# EAGLE schematic eNode_Spark (EAGLE 6.4)

## Sheet 1 of 3: Power & MCU
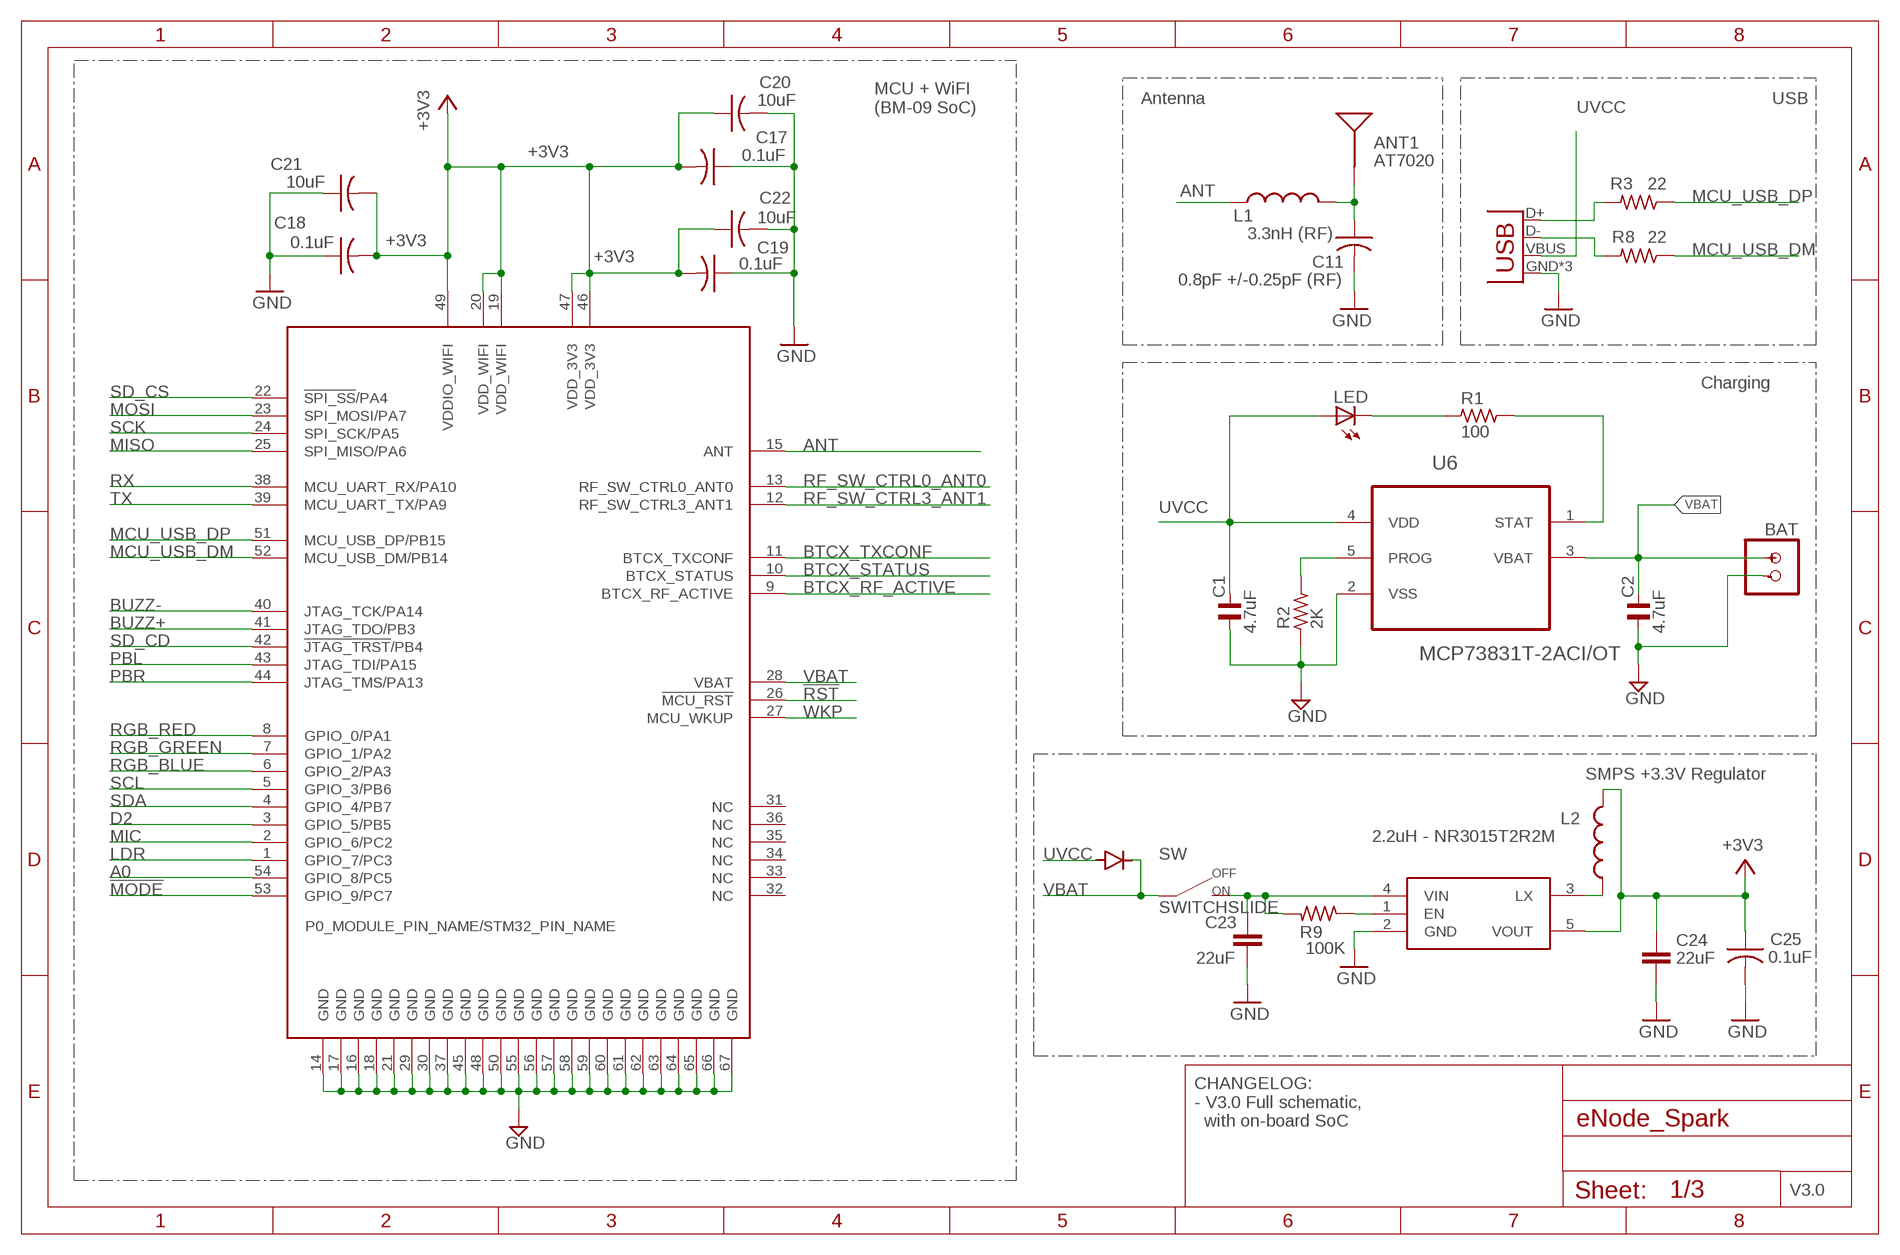
[diagram p0: schematic, sheet 1]

### Parts
ANT1  AT7020  [AT7020]
BAT  BATTERYSMT  [JST-2-SMD]
C1  4.7uF  C_0402  [C0402]
C2  4.7uF  C_0402  [C0402]
C11  0.8pF +/-0.25pF (RF)  C-US  [C0402_B]
C17  0.1uF  C-US  [C0402_B]
C18  0.1uF  C-US  [C0402_B]
C19  0.1uF  C-US  [C0402_B]
C20  10uF  C-US  [C0402_B]
C21  10uF  C-US  [C0402_B]
C22  10uF  C-US  [C0402_B]
C23  22uF  C-EUC0603  [C0603]
C24  22uF  C-EUC0603  [C0603]
C25  0.1uF  C-USC0402  [C0402]
D1  DIODE  [DIODE-DO-220AA(SMP)]
L1  3.3nH (RF)  INDUCTOR  [L0402_B]
L2  2.2uH - NR3015T2R2M  INDUCTORB  [INDUCTOR-NR3015]
LED  LED  [RA_SMD_LED]
R1  100  R_0603  [R0603]
R2  2K  R_0603  [R0603]
R3  22  R-US_  [R0402_B]
R8  22  R-US_  [R0402_B]
R9  100K  R-US_  [R0402_B]
SW  SWITCHSLIDE  [CHANGE_OVER_SLIDE]
U6  MCP73831T-2ACI/OT  [SOT95P280X145-5N]
U10  WM-N-BM-09  [WM-N-BM-09]
U$7  R8008-33  [SOT23-5]
X1  USB-MICROB  USBUSB-MICROB-SLOT-HOLE  [USB-MICROB-SLOT-HOLE]

### Nets
!MODE: U10.53(GPIO_9/PC7)
!RST: U10.26(!MCU_RST)
+3V3: C17.2 C18.2 C19.2 C20.1 C21.2 C22.1 C24.1 C25.1 L2.2 U10.19(VDD_WIFI) U10.20(VDD_WIFI) U10.46(VDD_3V3) U10.47(VDD_3V3) U10.49(VDDIO_WIFI) U$7.5(VOUT) ; also sheet 2,3
A0: U10.54(GPIO_8/PC5)
ANT [RF]: L1.1 U10.15(ANT)
BTCX_RF_ACTIVE: U10.9(BTCX_RF_ACTIVE)
BTCX_STATUS: U10.10(BTCX_STATUS)
BTCX_TXCONF: U10.11(BTCX_TXCONF)
BUZZ+: U10.41(JTAG_TDO/PB3) ; also sheet 3
BUZZ-: U10.40(JTAG_TCK/PA14) ; also sheet 3
D2: U10.3(GPIO_5/PB5)
ENABLE [vcc]: R9.1 U$7.1(EN)
GND: BAT.- C1.1 C2.1 C11.2 C17.1 C18.1 C19.1 C20.2 C21.1 C22.2 C23.2 C24.2 C25.2 R2.1 U6.2(VSS) U10.14(GND) U10.16(GND) U10.17(GND) U10.18(GND) U10.21(GND) U10.29(GND) U10.30(GND) U10.37(GND) U10.45(GND) U10.48(GND) U10.50(GND) U10.55(GND) U10.56(GND) U10.57(GND) U10.58(GND) U10.59(GND) U10.60(GND) U10.61(GND) U10.62(GND) U10.63(GND) U10.64(GND) U10.65(GND) U10.66(GND) U10.67(GND) U$7.2(GND) X1.GND X1.MT1(GND) X1.MT2(GND) ; also sheet 2,3
LDR: U10.1(GPIO_7/PC3) ; also sheet 3
MCU_USB_DM: R8.1 U10.52(MCU_USB_DM/PB14)
MCU_USB_DP: R3.1 U10.51(MCU_USB_DP/PB15)
MIC: U10.2(GPIO_6/PC2) ; also sheet 3
MISO: U10.25(SPI_MISO/PA6) ; also sheet 3
MOSI: U10.23(SPI_MOSI/PA7) ; also sheet 3
N$1 [RF]: ANT1.1(SIGNAL) C11.1 L1.2
N$3: L2.1 U$7.3(LX)
N$4: R2.2 U6.5(PROG)
N$5: LED.C R1.1
N$6: R1.2 U6.1(STAT)
N$17: R8.2 X1.D-
N$18: R3.2 X1.D+
PBL: U10.43(JTAG_TDI/PA15) ; also sheet 3
PBR: U10.44(JTAG_TMS/PA13) ; also sheet 3
RF_SW_CTRL0_ANT0: U10.13(RF_SW_CTRL0_ANT0)
RF_SW_CTRL3_ANT1: U10.12(RF_SW_CTRL3_ANT1)
RGB_BLUE: U10.6(GPIO_2/PA3) ; also sheet 3
RGB_GREEN [vcc]: U10.7(GPIO_1/PA2) ; also sheet 3
RGB_RED: U10.8(GPIO_0/PA1) ; also sheet 3
RX: U10.38(MCU_UART_RX/PA10) ; also sheet 3
SCK: U10.24(SPI_SCK/PA5) ; also sheet 3
SCL: U10.5(GPIO_3/PB6) ; also sheet 2
SD_CD: U10.42(!JTAG_TRST!/PB4) ; also sheet 3
SD_CS: U10.22(!SPI_SS!/PA4) ; also sheet 3
SDA: U10.4(GPIO_4/PB7) ; also sheet 2
TX: U10.39(MCU_UART_TX/PA9) ; also sheet 3
UVCC: C1.2 D1.ANODE LED.A U6.4(VDD) X1.VBUS
VBAT: BAT.+ C2.2 C23.1 D1.CATHODE R9.2 SW.1 SW.2 U6.3(VBAT) U10.28(VBAT) U$7.4(VIN)
WKP: U10.27(MCU_WKUP)
Unconnected: U10.31(NC) U10.32(NC) U10.33(NC) U10.34(NC) U10.35(NC) U10.36(NC)

### Notes on the sheet
- Antenna | USB
- MCU + WiFI
  (BM-09 SoC)
- Charging
- SMPS +3.3V Regulator
- CHANGELOG:
  - V3.0 Full schematic, 
    with on-board SoC
- V3.0

## Sheet 2 of 3: I2C
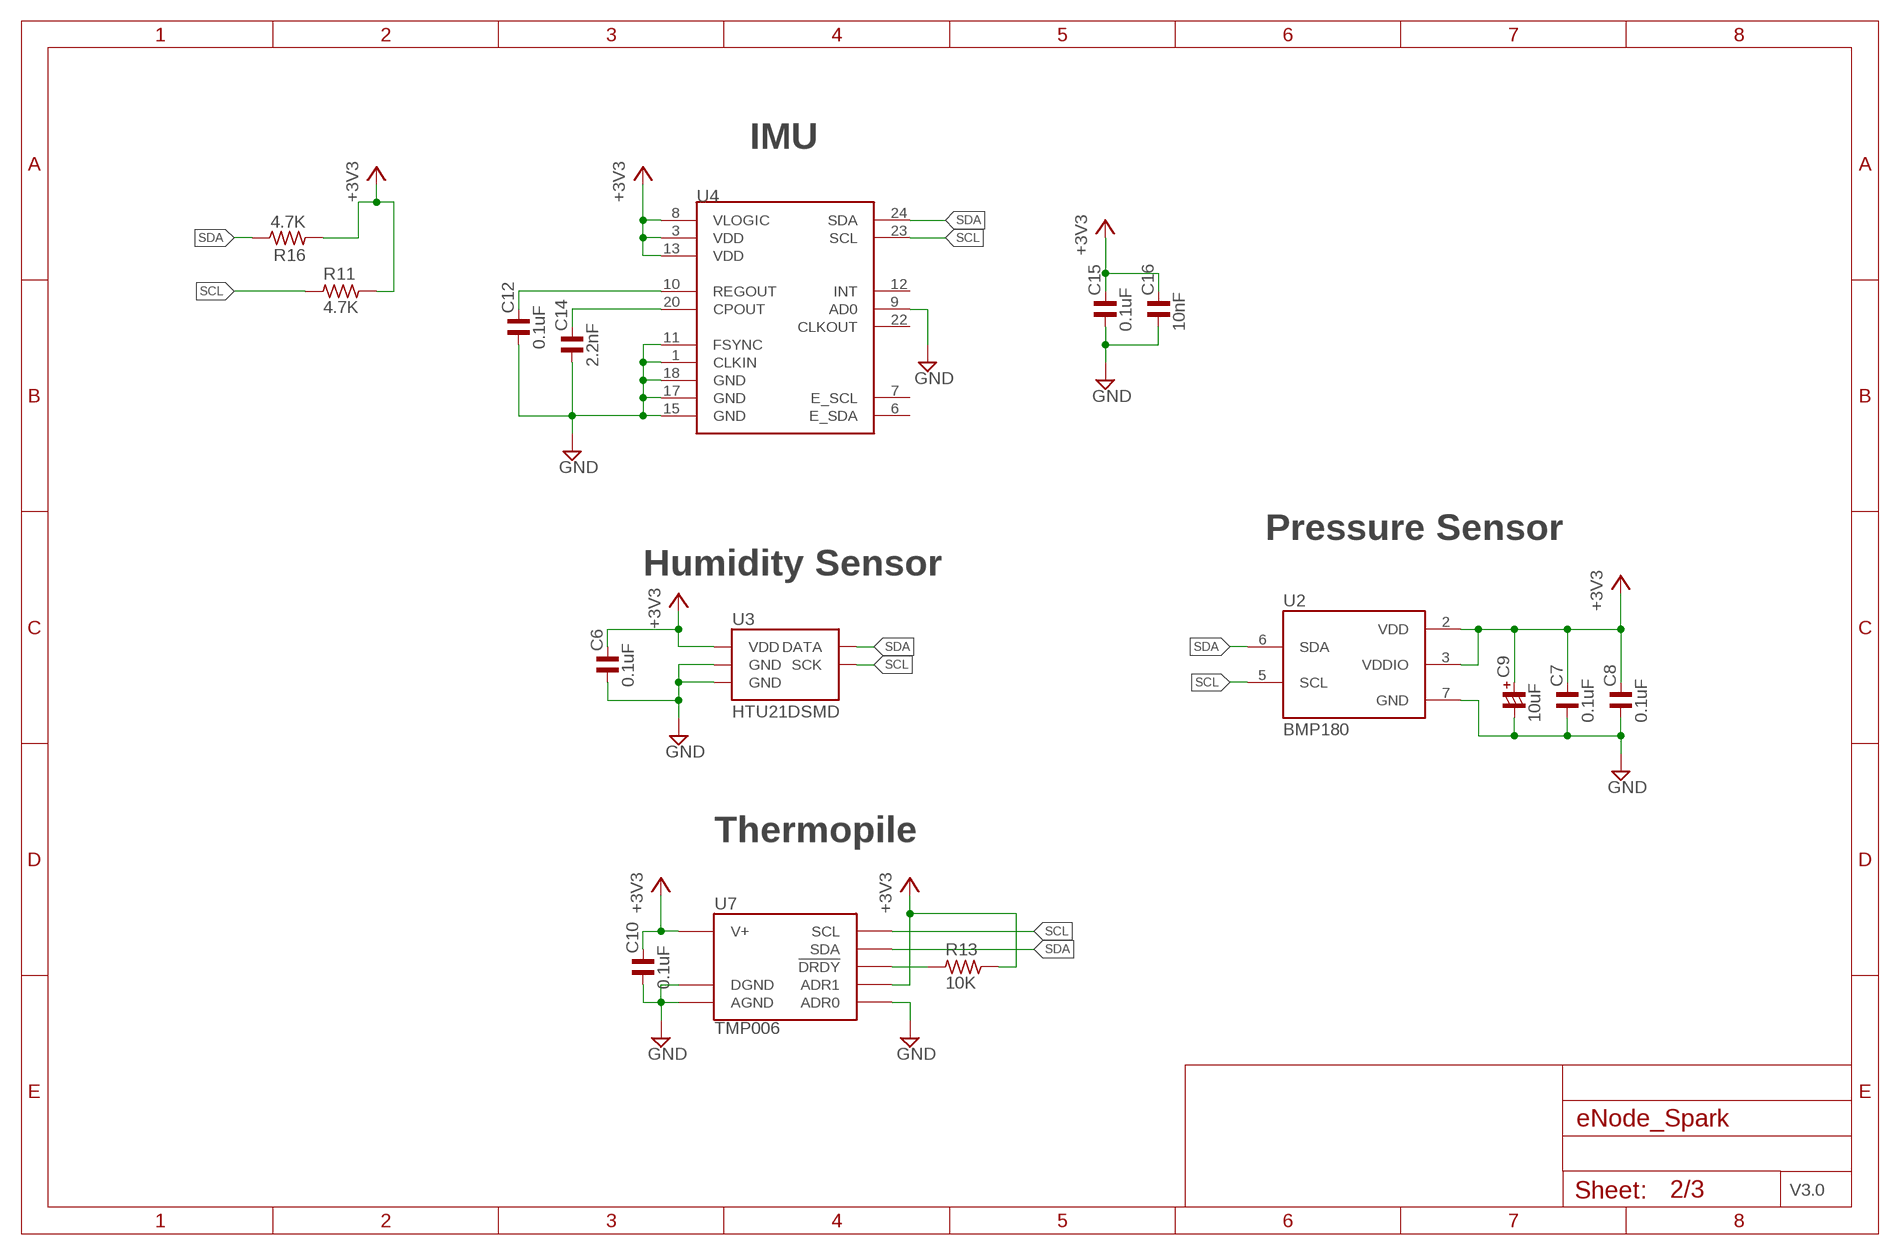
[diagram p1: schematic, sheet 2]

### Parts
C6  0.1uF  C_0402  [C0402]
C7  0.1uF  C_0402  [C0402]
C8  0.1uF  C_0402  [C0402]
C9  10uF  CP_1206/T  [C1206/T]
C10  0.1uF  C_0402  [C0402]
C12  0.1uF  C_0402  [C0402]
C14  2.2nF  C_0402  [C0402]
C15  0.1uF  C_0402  [C0402]
C16  10nF  C_0402  [C0402]
R11  4.7K  R_0603  [R0603]
R13  10K  R_0603  [R0603]
R16  4.7K  R_0603  [R0603]
U2  BMP180  [BMP180]
U3  HTU21DSMD  [HTU21D]
U4  MPU-9150QFN-24-NP  [QFN-24-NP]
U7  TMP006  [BGA8DS]

### Nets
+3V3: C6.2 C7.2 C8.2 C9.+ C10.2 C15.2 C16.2 R11.2 R13.2 R16.1 U2.2(VDD) U2.3(VDDIO) U3.VDD U4.3(VDD) U4.8(VLOGIC) U4.13(VDD) U7.A3(V+) U7.B1(ADR1) ; also sheet 1,3
GND: C6.1 C7.1 C8.1 C9.- C10.1 C12.1 C14.1 C15.1 C16.1 U2.7(GND) U3.7(GND) U3.GND U4.1(CLKIN) U4.9(AD0) U4.11(FSYNC) U4.15(GND) U4.17(GND) U4.18(GND) U7.A1(DGND) U7.A2(AGND) U7.C1(ADR0) ; also sheet 1,3
N$12: C14.2 U4.20(CPOUT)
N$13: R13.1 U7.C2(!DRDY)
N$14: C12.2 U4.10(REGOUT)
SCL: R11.1 U2.5(SCL) U3.SCK U4.23(SCL) U7.B3(SCL) ; also sheet 1
SDA: R16.2 U2.6(SDA) U3.DATA U4.24(SDA) U7.C3(SDA) ; also sheet 1
Unconnected: U4.6(E_SDA) U4.7(E_SCL) U4.12(INT) U4.22(CLKOUT)

### Notes on the sheet
- IMU
- Pressure Sensor
- Humidity Sensor
- Thermopile
- V3.0

## Sheet 3 of 3: Other IO
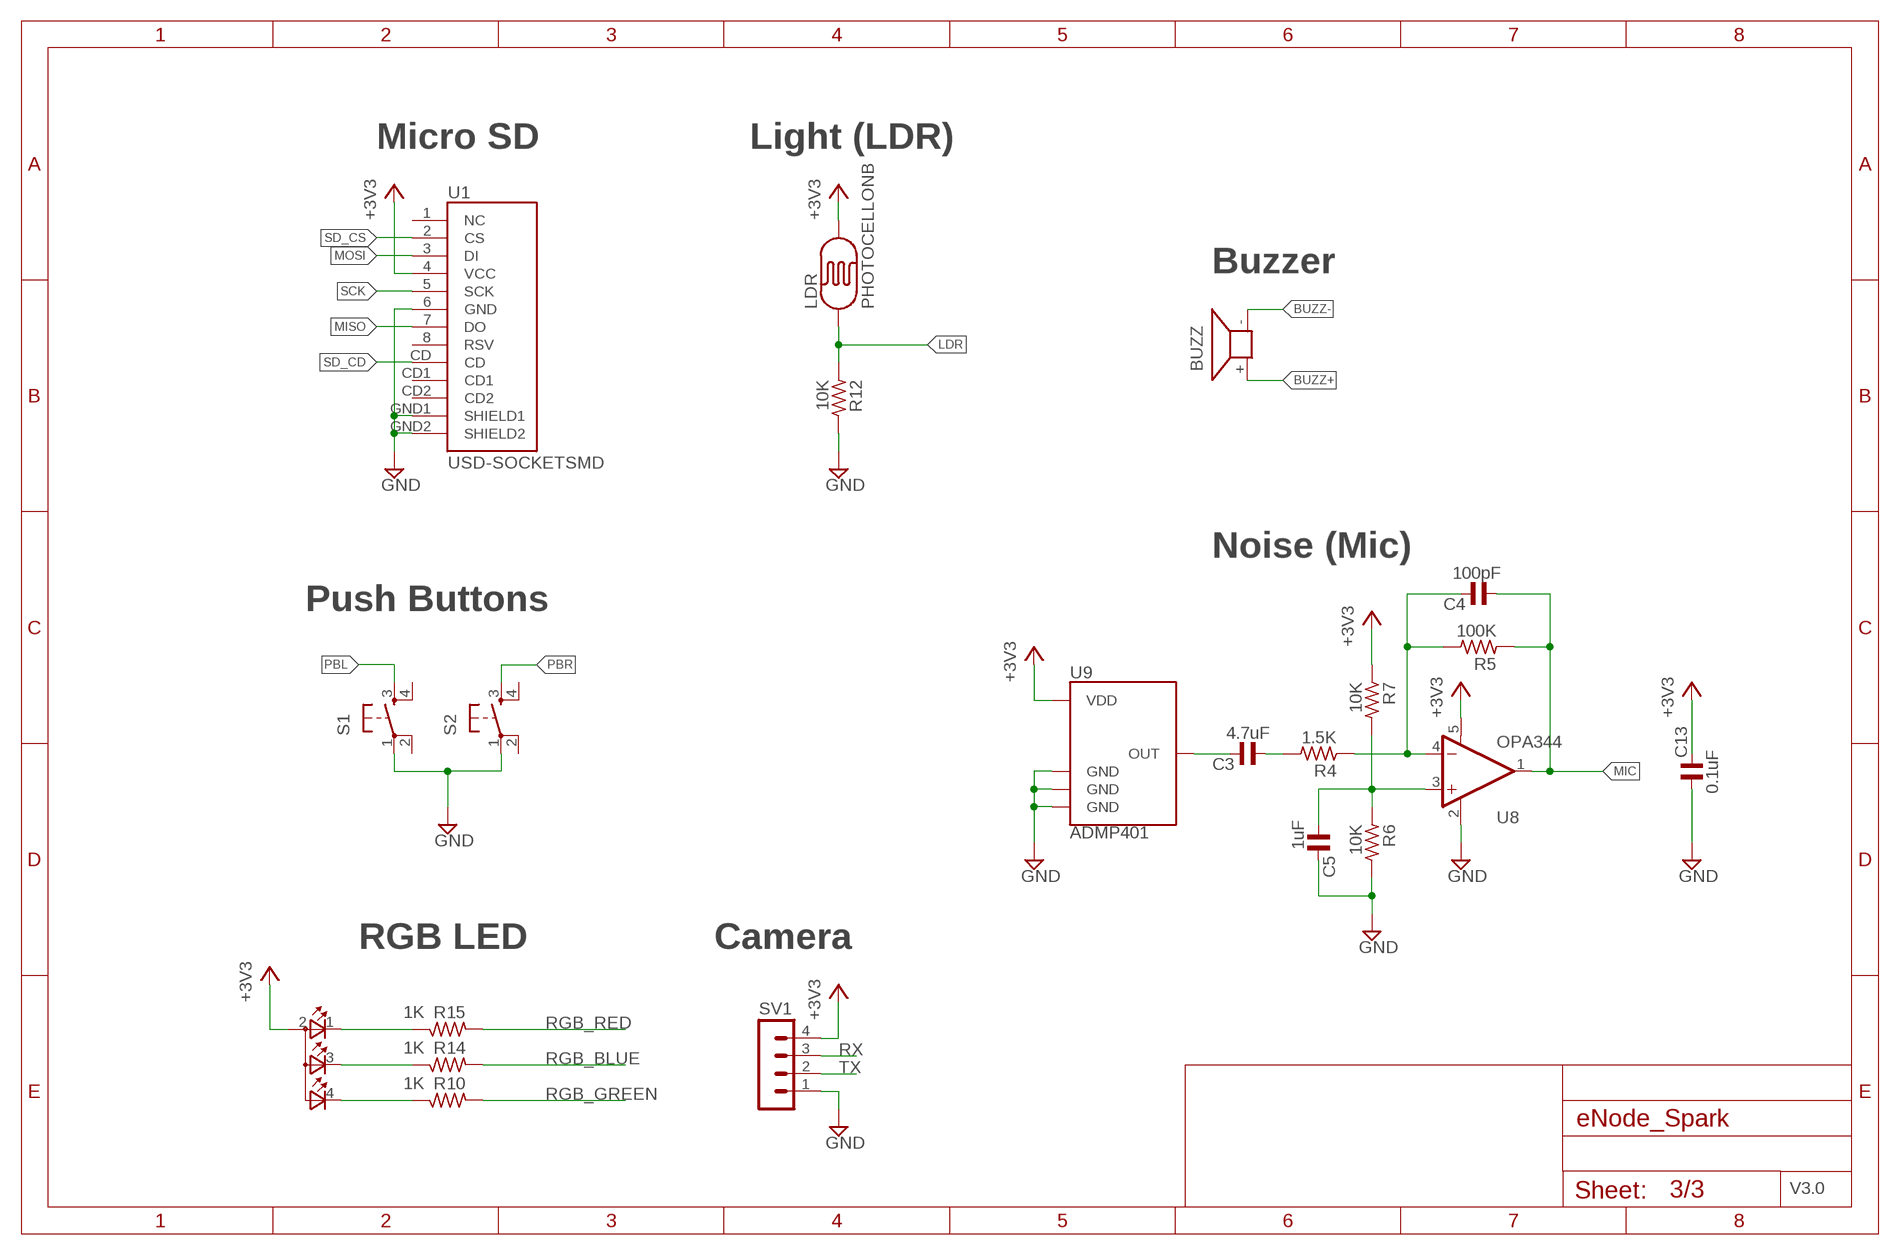
[diagram p2: schematic, sheet 3]

### Parts
BUZZ  BUZZER  [OFFBOARD_NOSIGN]
C3  4.7uF  C_0402  [C0402]
C4  100pF  C_0402  [C0402]
C5  1uF  C_0402  [C0402]
C13  0.1uF  C_0402  [C0402]
LDR  PHOTOCELLONB  [ON_BOARD]
LED2  CREE_CLVBA-FKA  TOPLED-3PLCC  [P-LCC-4-3]
R4  1.5K  R_0402  [R0402]
R5  100K  R_0402  [R0402]
R6  10K  R_0402  [R0402]
R7  10K  R_0402  [R0402]
R10  1K  R-US_  [R0402_B]
R12  10K  R_0603  [R0603]
R14  1K  R-US_  [R0402_B]
R15  1K  R-US_  [R0402_B]
S1  TAC_SWITCHSMD  [TACTILE_SWITCH_SMD]
S2  TAC_SWITCHSMD  [TACTILE_SWITCH_SMD]
SV1  MA04-1  [MA04-1]
U1  USD-SOCKETSMD  [MICRO-SD-SOCKET-PP]
U8  OPA344  [SOT23-5]
U9  ADMP401  [ADMP401]

### Nets
+3V3: C13.2 LDR.2 LED2.2(A2) R7.1 SV1.4 U1.4(VCC) U8.5(V+) U9.5(VDD) ; also sheet 1,2
BUZZ+: BUZZ.+ ; also sheet 1
BUZZ-: BUZZ.- ; also sheet 1
GND: C5.2 C13.1 R6.2 R12.2 S1.1 S2.1 SV1.1 U1.6(GND) U1.GND1(SHIELD1) U1.GND2(SHIELD2) U8.2(V-) U9.2(GND) U9.4(GND) U9.6(GND) ; also sheet 1,2
LDR: LDR.1 R12.1 ; also sheet 1
MIC: C4.1 R5.1 U8.1(OUT) ; also sheet 1
MISO: U1.7(DO) ; also sheet 1
MOSI: U1.3(DI) ; also sheet 1
N$2: C3.2 U9.1(OUT)
N$7: C3.1 R4.2
N$8: C4.2 R4.1 R5.2 U8.4(-IN)
N$9: C5.1 R6.1 R7.2 U8.3(+IN)
N$27: LED2.3(CBLUE) R14.1
N$29: LED2.4(CGREEN) R10.1
N$54: LED2.1(CRED) R15.1
PBL: S1.3 ; also sheet 1
PBR: S2.3 ; also sheet 1
RGB_BLUE: R14.2 ; also sheet 1
RGB_GREEN [vcc]: R10.2 ; also sheet 1
RGB_RED: R15.2 ; also sheet 1
RX: SV1.3 ; also sheet 1
SCK: U1.5(SCK) ; also sheet 1
SD_CD: U1.CD ; also sheet 1
SD_CS: U1.2(CS) ; also sheet 1
TX: SV1.2 ; also sheet 1
Unconnected: S1.2 S1.4 S2.2 S2.4 U1.1(NC) U1.8(RSV) U1.CD1 U1.CD2

### Notes on the sheet
- Micro SD | Light (LDR)
- Buzzer
- Noise (Mic)
- Push Buttons
- RGB LED | Camera
- V3.0

## Library data of the parts
ANT1 = Spark:AT7020
BAT = Battery:BATTERY: PIN HEADER
BUZZ = Buzzer:BUZZER: Buzzer
C1-C8 C10 C12-C16 = rc-master-smd:C_: NON-POLARIZED CAP
C9 = rc-master-smd:CP_: POLARIZED CAP
C11 C17-C22 = Spark:C-US: Capacitor
C23 C24 = rcl:C-EU: CAPACITOR, European symbol
C25 = adafruit:C-US: CAPACITOR, American symbol
D1 = Spark:DIODE
L1 L2 = Spark:INDUCTOR
LDR = LDR:PHOTOCELL: Photo Resitor
LED = LED:LED: LEDs
LED2 = SMD RGB LED:TOPLED-3: Cree CLVBA-FKA
R1 R2 R4-R7 R11-R13 R16 = rc-master-smd:R_: RESISTOR
R3 R8-R10 R14 R15 = Spark:R-US_: 0402 Resistor
S1 S2 = TACT BUTTON:TAC_SWITCH: SMD Tactiile Switch
SV1 = con-lstb:MA04-1: PIN HEADER; OC_FARNELL: unknown; OC_NEWARK: unknown
SW = Switch:SWITCH
U1 = MicroSD:USD-SOCKET: microSD Socket Push-push type uSD socket. Schematic element and footprint production proven. Spark Fun Electronics SKU : PRT-00127. tDoc lines correctly indicate media card edge positions when inserting (unlocked, locked, depressed).; ORDERCODE: 2143377; SUPPLIER: ELEMENT14
U2 = BMP180:BMP180: BOSCH BMP180 DIGITAL BAROMETRIC PRESSURE SENSOR Web page: http://www.bosch-sensortec.com/en/homepage/products_3/environmental_sensors_1/bmp180_1/bmp180 Datasheet: http://ae-bst.resource.bosch.com/media/products/dokumente/bmp180/BST-BMP180-DS000-09.pdf The BMP180 is the function compatible successor of the BMP085, a new generation of high precision digital pressure sensors for consumer applications. The ultra-low power, low voltage electronics of the BMP180 is optimized for use in mobile phones, PDAs, GPS navigation devices and outdoor equipment. With a low altitude noise of merely 0.25m at fast conversion time, the BMP180 offers superior performance. The I2C interface allows for easy system integration with a microcontroller. The BMP180 is based on piezo-resistive technology for EMC robustness, high accuracy and linearity as well as long term stability. Key features: - Temperature measurement included - I2C interface - Fully calibrated - Pb-free, halogen-free and RoHS compliant, - MSL 1 Basic specs: Pressure range: 300 to 1100hPa (+9000m to -500m relating to sea level) Supply voltage: 1.8 to 3.6V (VDD), 1.62V to 3.6V (VDDIO) Package: LGA package with metal lid Small footprint: 3.6mm x 3.8mm Super-flat: 0.93mm height Low power: 5µA at 1 sample / sec. in standard mode Low noise: 0.06hPa (0.5m) in ultra low power mode, 0.02hPa (0.17m) advanced resolution mode Typical applications: - Enhancement of GPS navigation (dead-reckoning, slope detection, etc.) - In- and out-door navigation - Leisure and sports - Weather forecast - Vertical velocity indication (rise/sink speed)
U3 = HTU21D:HTU21D
U4 = MPU-9150:MPU-9150: 9DOF (3mag, 3accel, 3rotat). I2C interface.
U6 = MCP73831T (LiPo Charger):MCP73831T-2ACI/OT: Charge Management Controller; MPN: MCP73831T-2ACI/OT; OC_FARNELL: 1332158; OC_NEWARK: 56K7045; PACKAGE: SOT-5; SUPPLIER: Microchip
U7 = TMP006:TMP006
U8 = OPA344:OPA344
U9 = ADMP401:ADMP401
U10 = Spark:WM-N-BM-09
U$7 = Spark:R8008-33
X1 = Spark:USB

## Net classes
2 RF: width 0.33 mm, clearance 0.178 mm